# Altium schematic sheet 15 BOOT.SchDoc
size A2; ApprovedBy: DNP; CheckedBy: DNP; Author: DNP; CompanyName: Google LLC; DrawnBy: DNP; Organization: Google LLC; Address1: 1600 Amphitheatre Parkway; Address2: Mountain View, CA 94043; Address3: DNP; Address4: DNP; DocumentNumber: 15; SheetNumber: 15; SheetTotal: 17; VersionControl_RevNumber: DNP; IsUserConfigurable: DNP; Time: DNP; ImagePath: DNP; Rule: DNP; ProjectName: Enterprise; Application_BuildNumber: DNP
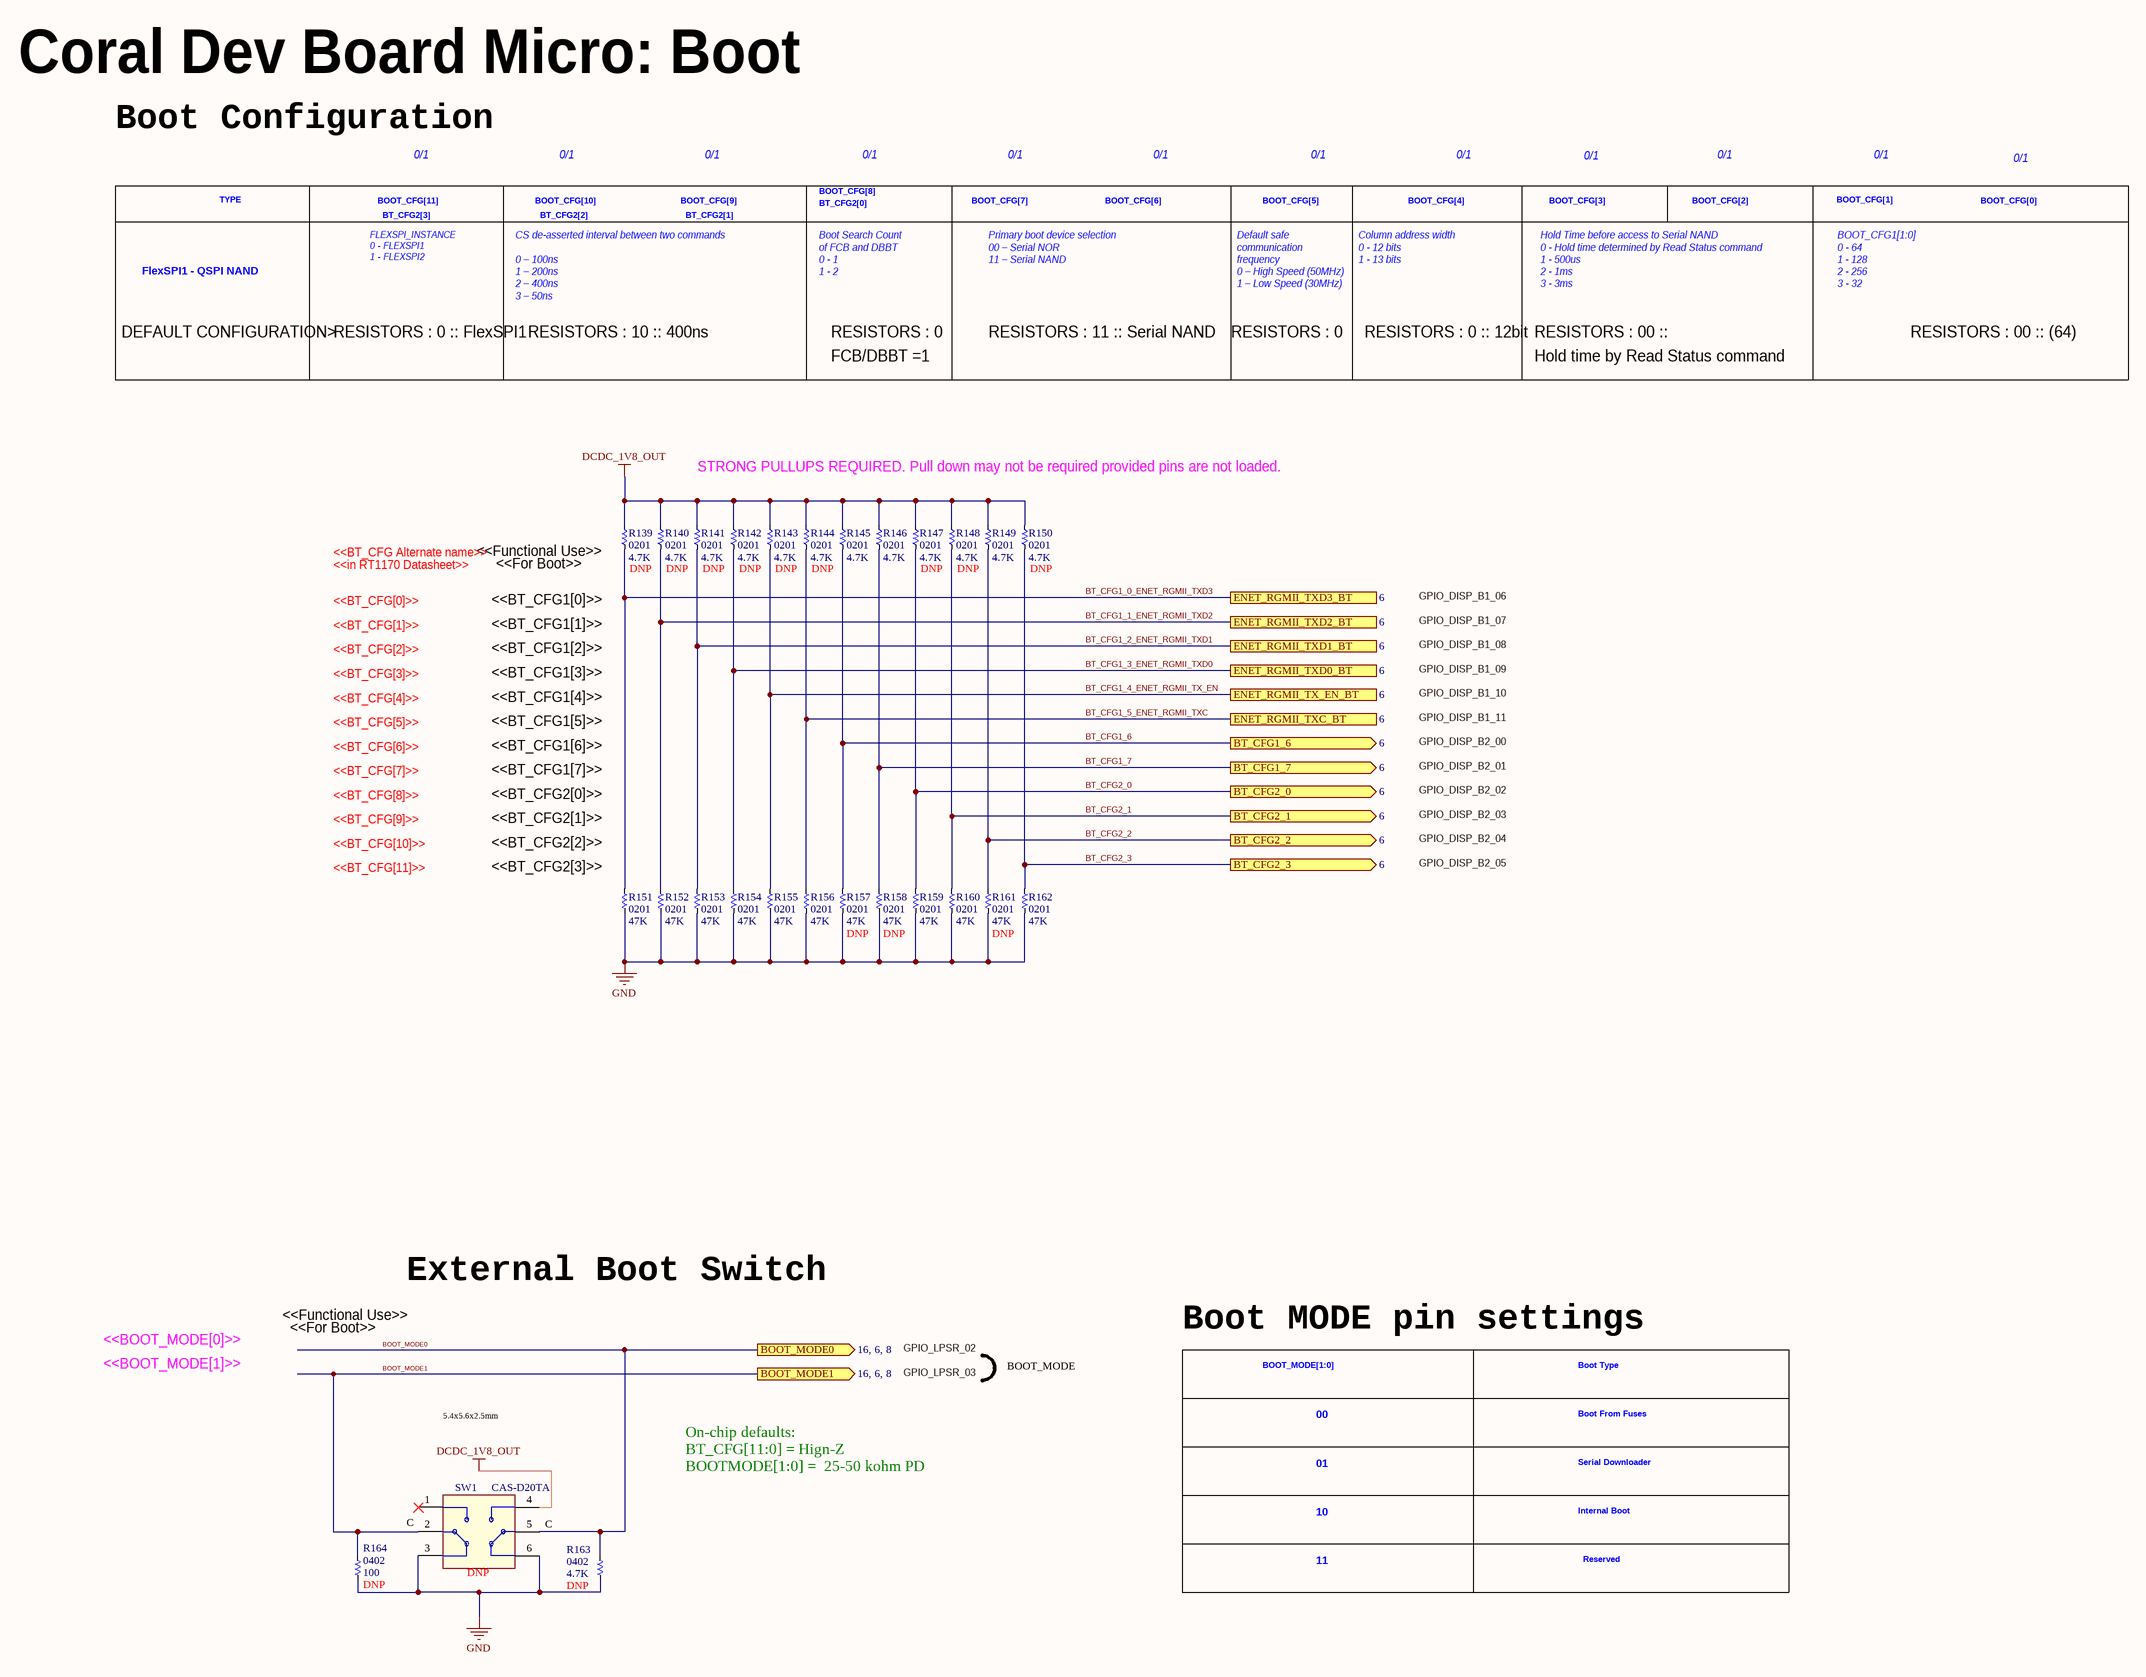
[diagram p0: 15 BOOT.SchDoc]

## Parts
R139  value 4.7K  Package: 0201  [R0201]
R140  value 4.7K  Package: 0201  [R0201]
R141  value 4.7K  Package: 0201  [R0201]
R142  value 4.7K  Package: 0201  [R0201]
R143  value 4.7K  Package: 0201  [R0201]
R144  value 4.7K  Package: 0201  [R0201]
R145  value 4.7K  Package: 0201  [R0201]
R146  value 4.7K  Package: 0201  [R0201]
R147  value 4.7K  Package: 0201  [R0201]
R148  value 4.7K  Package: 0201  [R0201]
R149  value 4.7K  Package: 0201  [R0201]
R150  value 4.7K  Package: 0201  [R0201]
R151  value 47K  Package: 0201  [R0201]
R152  value 47K  Package: 0201  [R0201]
R153  value 47K  Package: 0201  [R0201]
R154  value 47K  Package: 0201  [R0201]
R155  value 47K  Package: 0201  [R0201]
R156  value 47K  Package: 0201  [R0201]
R157  value 47K  Package: 0201  [R0201]
R158  value 47K  Package: 0201  [R0201]
R159  value 47K  Package: 0201  [R0201]
R160  value 47K  Package: 0201  [R0201]
R161  value 47K  Package: 0201  [R0201]
R162  value 47K  Package: 0201  [R0201]
R163  value 4.7K  Package: 0402  [R0402]
R164  value 100  Package: 0402  [R0402]
SW1  MFG P/N: CAS-D20TA  [SWITCH_CAS-D20TA]  (hidden comment: SWITCH_NIDEC_CAS-D20TA)

## Ports
BOOT_MODE0 (out, see 16, 6, 8), BOOT_MODE1 (out, see 16, 6, 8), BT_CFG1_6 (out, see 6), BT_CFG1_7 (out, see 6), BT_CFG2_0 (out, see 6), BT_CFG2_1 (out, see 6), BT_CFG2_2 (out, see 6), BT_CFG2_3 (out, see 6), ENET_RGMII_TX_EN_BT (see 6), ENET_RGMII_TXC_BT (see 6), ENET_RGMII_TXD0_BT (see 6), ENET_RGMII_TXD1_BT (see 6), ENET_RGMII_TXD2_BT (see 6), ENET_RGMII_TXD3_BT (see 6)

## Nets
DCDC_1V8_OUT: R139.2 R140.2 R141.2 R142.2 R143.2 R144.2 R145.2 R146.2 R147.2 R148.2 R149.2 R150.2 SW1.4
GND: R151.2 R152.2 R153.2 R154.2 R155.2 R156.2 R157.2 R158.2 R159.2 R160.2 R161.2 R162.2 R163.1 R164.1 SW1.3 SW1.6
BOOT_MODE0: R163.2 SW1.5 ; port BOOT_MODE0
BOOT_MODE1: R164.2 SW1.2 ; port BOOT_MODE1
BT_CFG1_0_ENET_RGMII_TXD3: R139.1 R151.1 ; port ENET_RGMII_TXD3_BT
BT_CFG1_1_ENET_RGMII_TXD2: R140.1 R152.1 ; port ENET_RGMII_TXD2_BT
BT_CFG1_2_ENET_RGMII_TXD1: R141.1 R153.1 ; port ENET_RGMII_TXD1_BT
BT_CFG1_3_ENET_RGMII_TXD0: R142.1 R154.1 ; port ENET_RGMII_TXD0_BT
BT_CFG1_4_ENET_RGMII_TX_EN: R143.1 R155.1 ; port ENET_RGMII_TX_EN_BT
BT_CFG1_5_ENET_RGMII_TXC: R144.1 R156.1 ; port ENET_RGMII_TXC_BT
BT_CFG1_6: R145.1 R157.1 ; port BT_CFG1_6
BT_CFG1_7: R146.1 R158.1 ; port BT_CFG1_7
BT_CFG2_0: R147.1 R159.1 ; port BT_CFG2_0
BT_CFG2_1: R148.1 R160.1 ; port BT_CFG2_1
BT_CFG2_2: R149.1 R161.1 ; port BT_CFG2_2
BT_CFG2_3: R150.1 R162.1 ; port BT_CFG2_3

Not connected (* = marked no-connect by the designer): SW1 1*

## Notes on the sheet
- Coral Dev Board Micro: Boot
- Boot Configuration
- 0/1
- TYPE
- BOOT_CFG[11]
- BT_CFG2[3]
- BOOT_CFG[10]
- BT_CFG2[2]
- BOOT_CFG[9]
- BT_CFG2[1]
- BOOT_CFG[8]
- BT_CFG2[0]
- BOOT_CFG[7]
- BOOT_CFG[6]
- BOOT_CFG[5]
- BOOT_CFG[4]
- BOOT_CFG[3]
- BOOT_CFG[2]
- BOOT_CFG[1]
- BOOT_CFG[0]
- FlexSPI1 - QSPI NAND
- FLEXSPI_INSTANCE
  0 - FLEXSPI1
  1 - FLEXSPI2
- Boot Search Count
  of FCB and DBBT
  0 - 1
  1 - 2
- Primary boot device selection
  00 – Serial NOR
  11 – Serial NAND
- Column address width
  0 - 12 bits
  1 - 13 bits
- BOOT_CFG1[1:0]
  0 - 64
  1 - 128
  2 - 256
  3 - 32
- DEFAULT CONFIGURATION>
- RESISTORS : 0 :: FlexSPI1
- CS de-asserted interval between two commands
  0 – 100ns
  1 – 200ns
  2 – 400ns
  3 – 50ns
- RESISTORS : 10 :: 400ns
- RESISTORS : 0
- RESISTORS : 11 :: Serial NAND
- Default safe
  communication
  frequency
  0 – High Speed (50MHz)
  1 – Low Speed (30MHz)
- RESISTORS : 0 :: 12bit
- RESISTORS : 00 ::
- Hold Time before access to Serial NAND
  0 - Hold time determined by Read Status command
  1 - 500us
  2 - 1ms
  3 - 3ms
- RESISTORS : 00 :: (64)
- FCB/DBBT =1
- Hold time by Read Status command
- STRONG PULLUPS REQUIRED. Pull down may not be required provided pins are not loaded.
- <<BT_CFG Alternate name>>
- <<in RT1170 Datasheet>>
- (near R139) <<Functional Use>>
- (near R139) <<For Boot>>
- <<BT_CFG[0]>>
- <<BT_CFG[1]>>
- <<BT_CFG1[0]>>
- <<BT_CFG1[1]>>
- GPIO_DISP_B1_06
- GPIO_DISP_B1_07
- GPIO_DISP_B1_08
- <<BT_CFG[2]>>
- <<BT_CFG[3]>>
- <<BT_CFG[4]>>
- <<BT_CFG1[2]>>
- <<BT_CFG1[3]>>
- <<BT_CFG1[4]>>
- GPIO_DISP_B1_09
- GPIO_DISP_B1_10
- <<BT_CFG[5]>>
- <<BT_CFG[6]>>
- <<BT_CFG1[5]>>
- <<BT_CFG1[6]>>
- GPIO_DISP_B1_11
- GPIO_DISP_B2_00
- GPIO_DISP_B2_01
- <<BT_CFG[7]>>
- <<BT_CFG[8]>>
- <<BT_CFG[9]>>
- <<BT_CFG1[7]>>
- <<BT_CFG2[0]>>
- <<BT_CFG2[1]>>
- GPIO_DISP_B2_02
- GPIO_DISP_B2_03
- <<BT_CFG[10]>>
- <<BT_CFG[11]>>
- <<BT_CFG2[2]>>
- (near R151) <<BT_CFG2[3]>>
- GPIO_DISP_B2_04
- GPIO_DISP_B2_05
- External Boot Switch
- <<BOOT_MODE[0]>>
- <<BOOT_MODE[1]>>
- <<For Boot>>
- <<Functional Use>>
- GPIO_LPSR_02
- GPIO_LPSR_03
- BOOT_MODE
- Boot MODE pin settings
- BOOT_MODE[1:0]
- Boot Type
- 5.4x5.6x2.5mm
- 00
- Boot From Fuses
- On-chip defaults:
  BT_CFG[11:0] = Hign-Z
  BOOTMODE[1:0] =  25-50 kohm PD
- 01
- Serial Downloader
- 10
- Internal Boot
- 11
- Reserved
- Project:
- Engineer:
- Date:
- File:
- Revision:
- Sheet
- of
- (in symbol 227) C

## Library data of the parts
R139-R150 = 6602: RES, 4.7K, 5%, 1/20W, 0201; ID: 6602; MFG: YAGEO; MFG P/N: RC0201JR-074K7L; COMMON: 470-00012-00; Status: Released; Power: 1/20W; Tolerance: 5%; LOON: 470-00012-00; Gecko: 470-00012-00; XPN: 470-00012-00
  R139-R144 R147 R148 R150: DNP: DNP
R151-R162 = 6833: RES, 47K, 5%, 1/20W, 0201; ID: 6833; MFG: PANASONIC; MFG P/N: ERJ1GEJ473C; COMMON: 470-00003-00; Status: NRND; Power: 1/20W; Tolerance: 5%; LOON: 470-00003-00; Gecko: 470-00003-00; XPN: 470-00003-00
  R157 R158 R161: DNP: DNP
R163 = 3866: RES, 4.7K, 1%, 1/10W, 0402; ID: 3866; MFG: PANASONIC; MFG P/N: ERJ-2RKF4701X; COMMON: 470-01775-00; PROXY: Use ID #8133; KOI: 470-17107-00; Status: Released; Power: 1/10W; Tolerance: 1%; Height: 0.40mm; Supplier 1: Digi-Key; XPN: 470-01775-00; Supplier Part Number 1: P4.70KLCT-ND; DNP: DNP
R164 = 6318: RES, 100, 5%, 1/16W, 0402, AUTO GRADE; ID: 6318; MFG: VISHAY; MFG P/N: CRCW0402100RJNED; COMMON: 470-02903-00; Status: Released; Power: 1/16W; Tolerance: 5%; XPN: 470-02903-00; DNP: DNP
SW1 = 227: SW, SLIDE, SPDTx2, 100mA, 6VDC, 2-POS, ON-ON, GOLD, SMT; ID: 227; MFG: Nidec Copal Electronics; Voltage, Rated: 6V; Status: Released; Category: Slide Switches; RoHS Compliant: Yes; Supplier 1: Digi-Key; Height: 2.5mm; Mounting Type: SMD; HelpURL: https://www.digikey.com/en/products/detail/nidec-copal-electronics/CAS-D20TA/341665; ComponentLink1Description: Datasheet; ComponentLink1URL: https://drive.google.com/file/d/1yHSGEBNR3CK8ELRyOJmK0djXwn1fRk_2/view; Supplier Part Number 1: CASD20JTR-ND; Features: Tape Seal; Operating Temperature: -40°C ~ 85°C; DNP: DNP